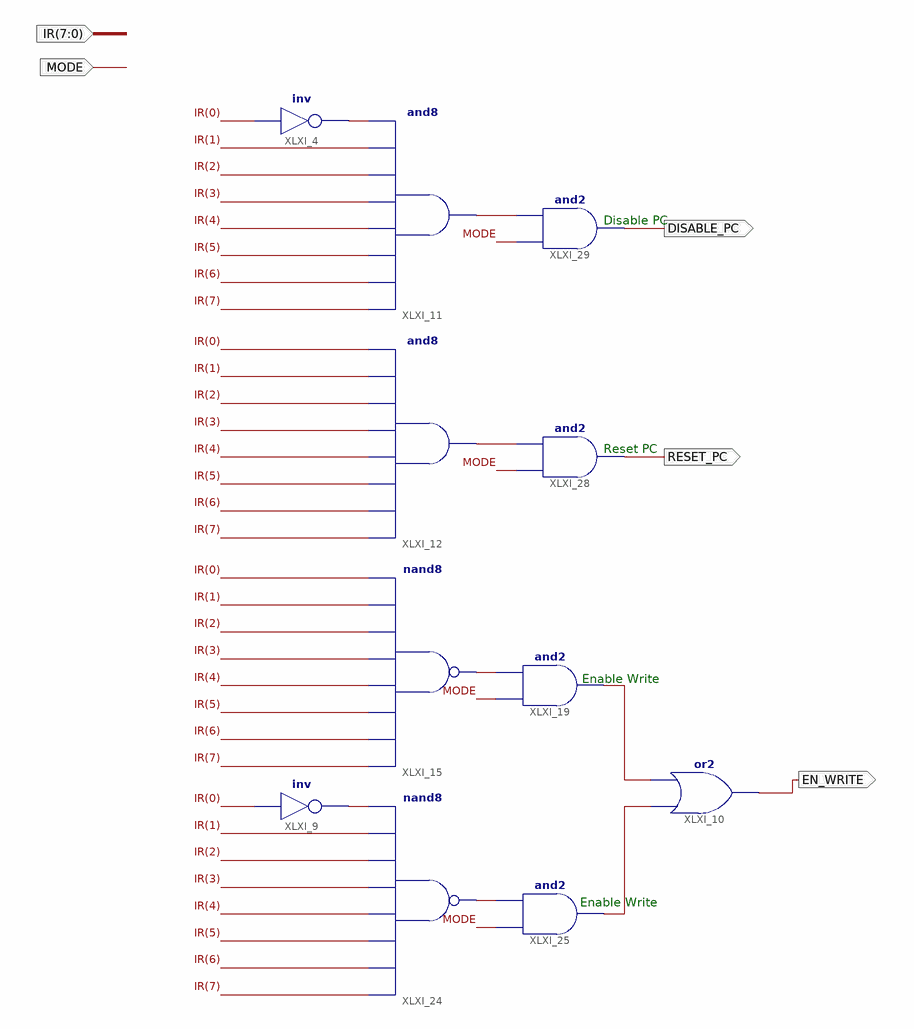
[diagram p0: schematic sheet 1]
// Xilinx ISE schematic CU_Misc.sch (spartan3e) as structural Verilog: 11 symbols, 5 ports
module CU_Misc (
  input  [7:0] IR,
  input  MODE,
  output EN_WRITE,
  output RESET_PC,
  output DISABLE_PC
);

  wire XLXN_3, XLXN_24, XLXN_45, XLXN_46, XLXN_92, XLXN_94, XLXN_118, XLXN_129;

  not XLXI_4 (XLXN_3, IR[0]);
  and XLXI_11 (XLXN_129, IR[7], IR[6], IR[5], IR[4], IR[3], IR[2], IR[1], XLXN_3);
  and XLXI_12 (XLXN_118, IR[7], IR[6], IR[5], IR[4], IR[3], IR[2], IR[1], IR[0]);
  nand XLXI_15 (XLXN_92, IR[7], IR[6], IR[5], IR[4], IR[3], IR[2], IR[1], IR[0]);
  and XLXI_19 (XLXN_45, MODE, XLXN_92);
  not XLXI_9 (XLXN_24, IR[0]);
  nand XLXI_24 (XLXN_94, IR[7], IR[6], IR[5], IR[4], IR[3], IR[2], IR[1], XLXN_24);
  and XLXI_25 (XLXN_46, MODE, XLXN_94);
  or XLXI_10 (EN_WRITE, XLXN_46, XLXN_45);
  and XLXI_28 (RESET_PC, MODE, XLXN_118);
  and XLXI_29 (DISABLE_PC, MODE, XLXN_129);

  // Notes on the sheet:
  //   Disable PC
  //   Reset PC
  //   Enable Write
  //   Enable Write
endmodule
